# EAGLE schematic Controller Board (EAGLE 8.5.1)

## Sheet 1 of 2
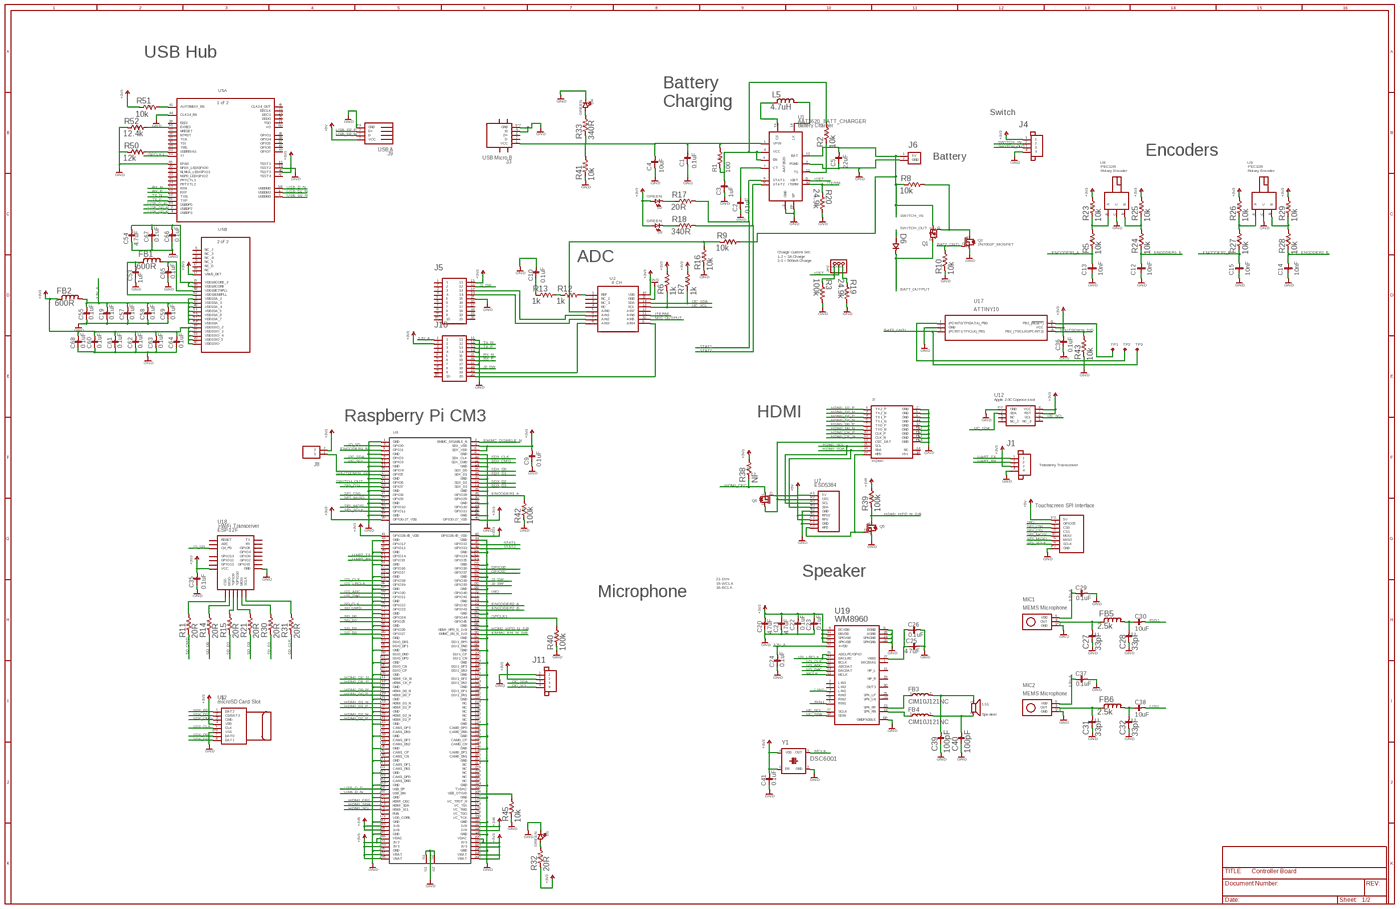
[diagram p0: schematic, sheet 1, overview]
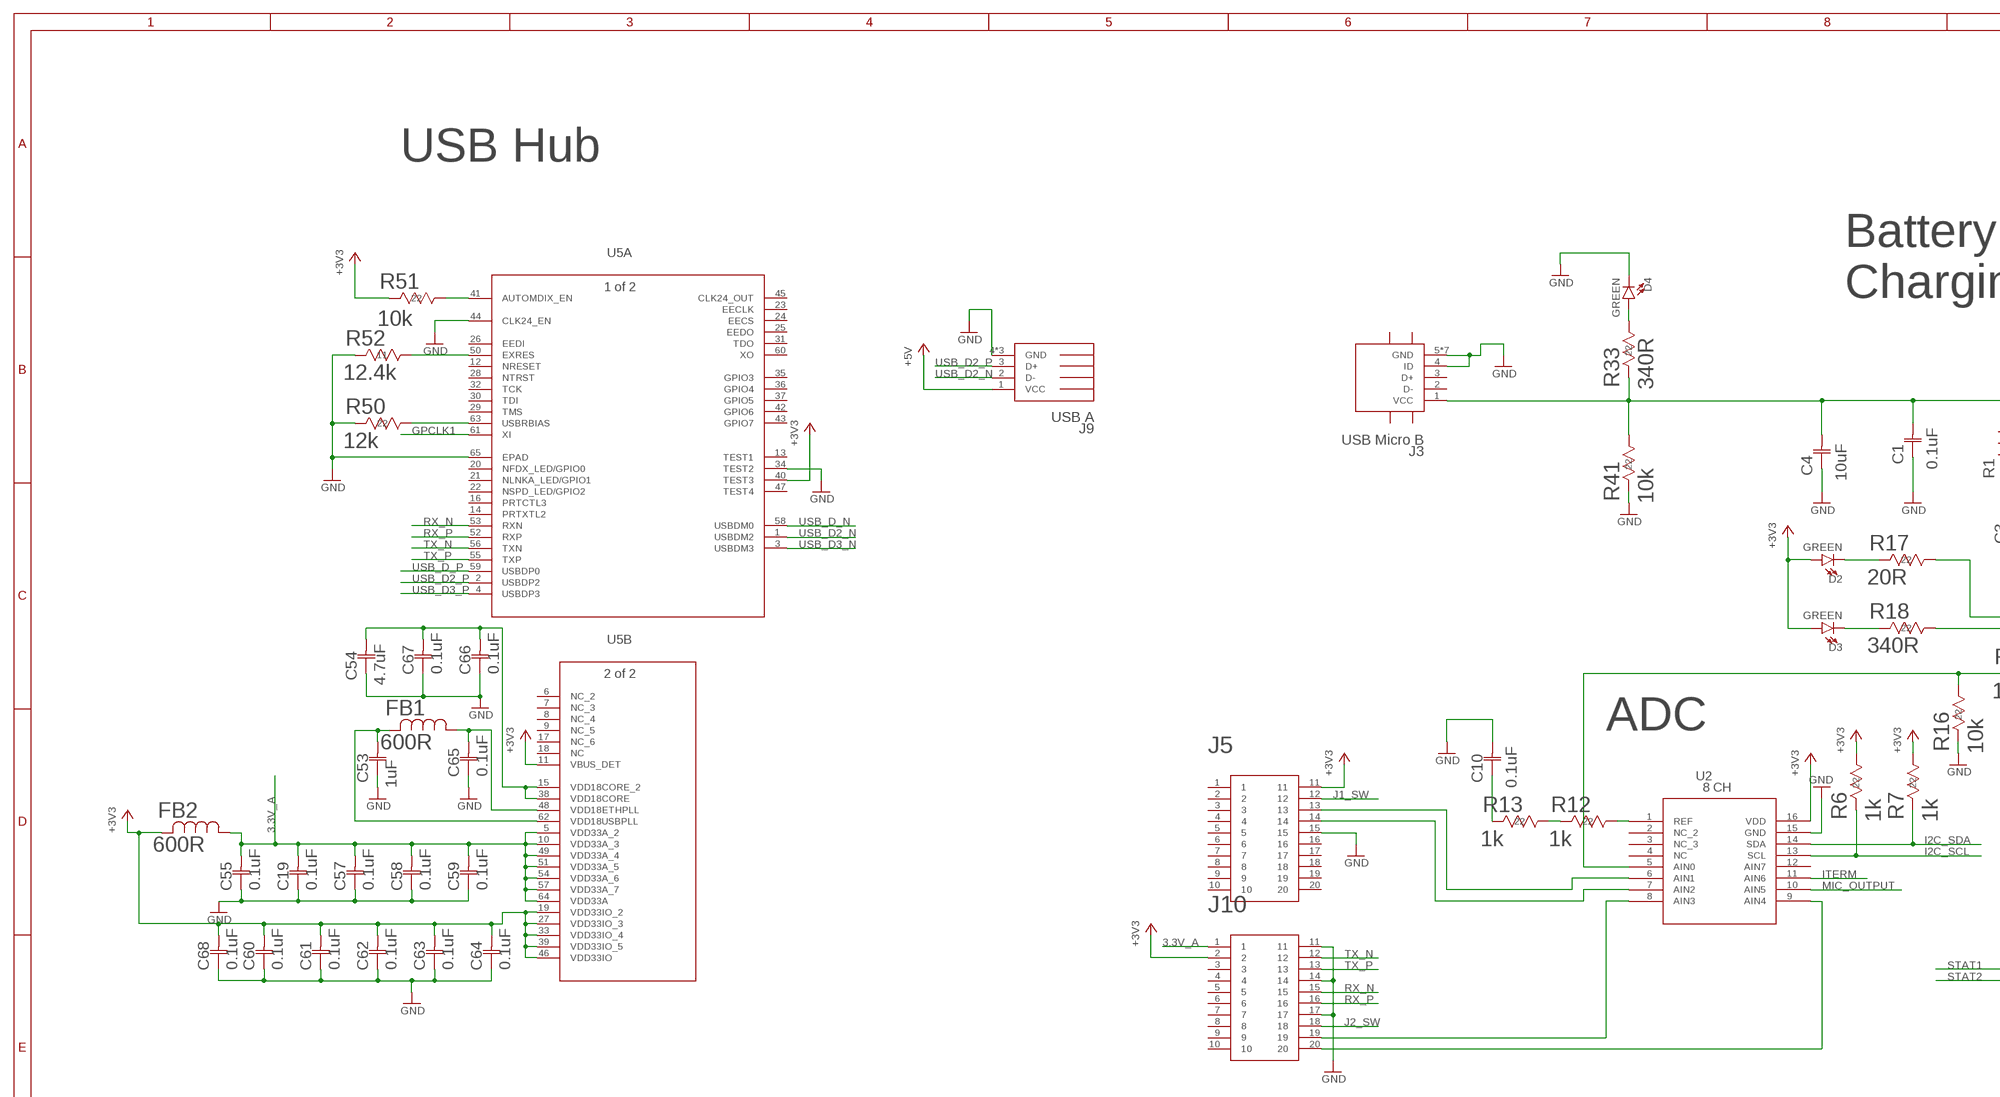
[diagram p1: schematic, sheet 1, part 1 of 4]
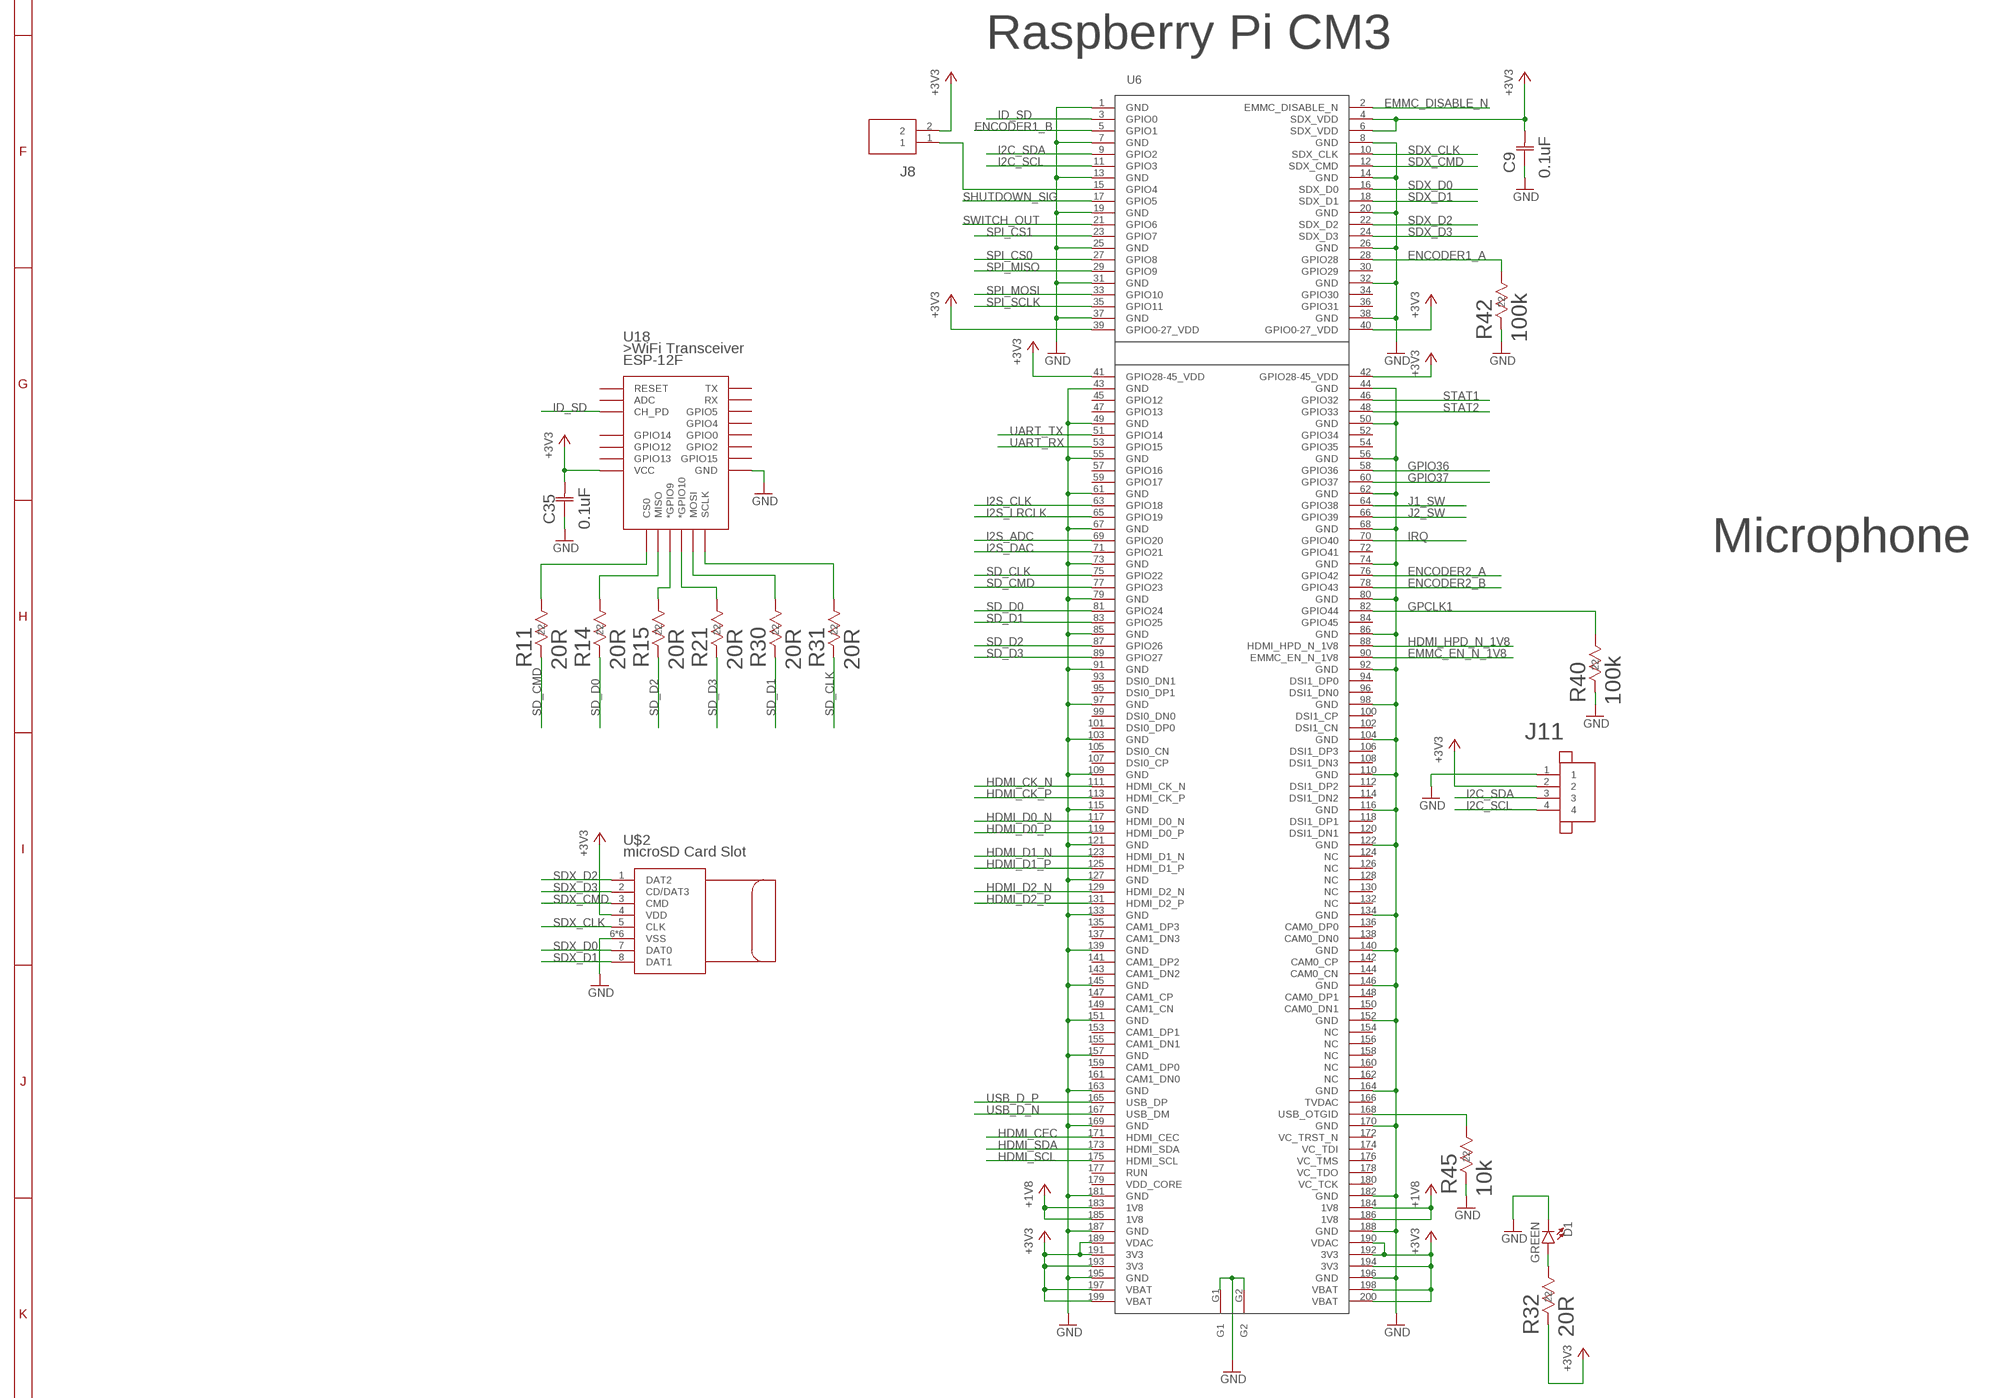
[diagram p2: schematic, sheet 1, part 2 of 4]
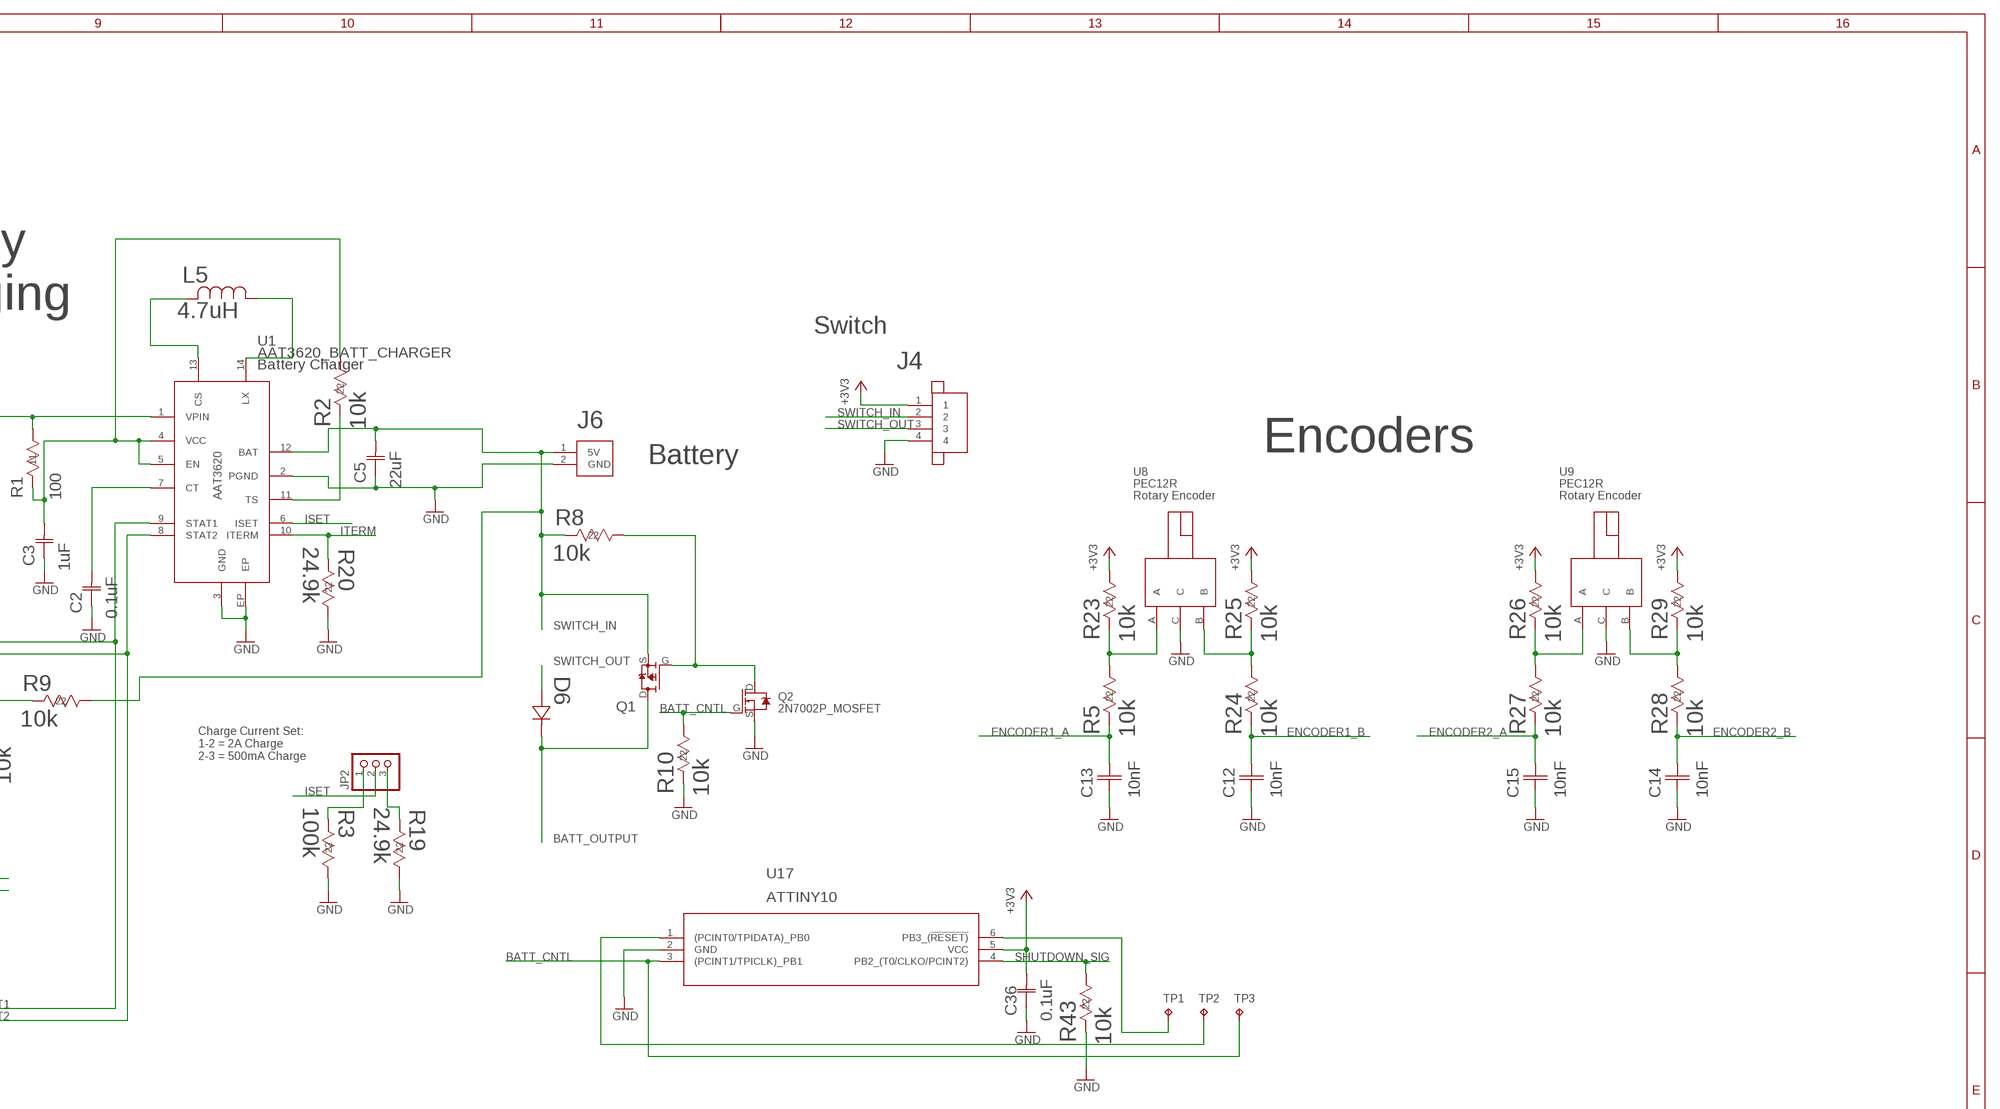
[diagram p3: schematic, sheet 1, part 3 of 4]
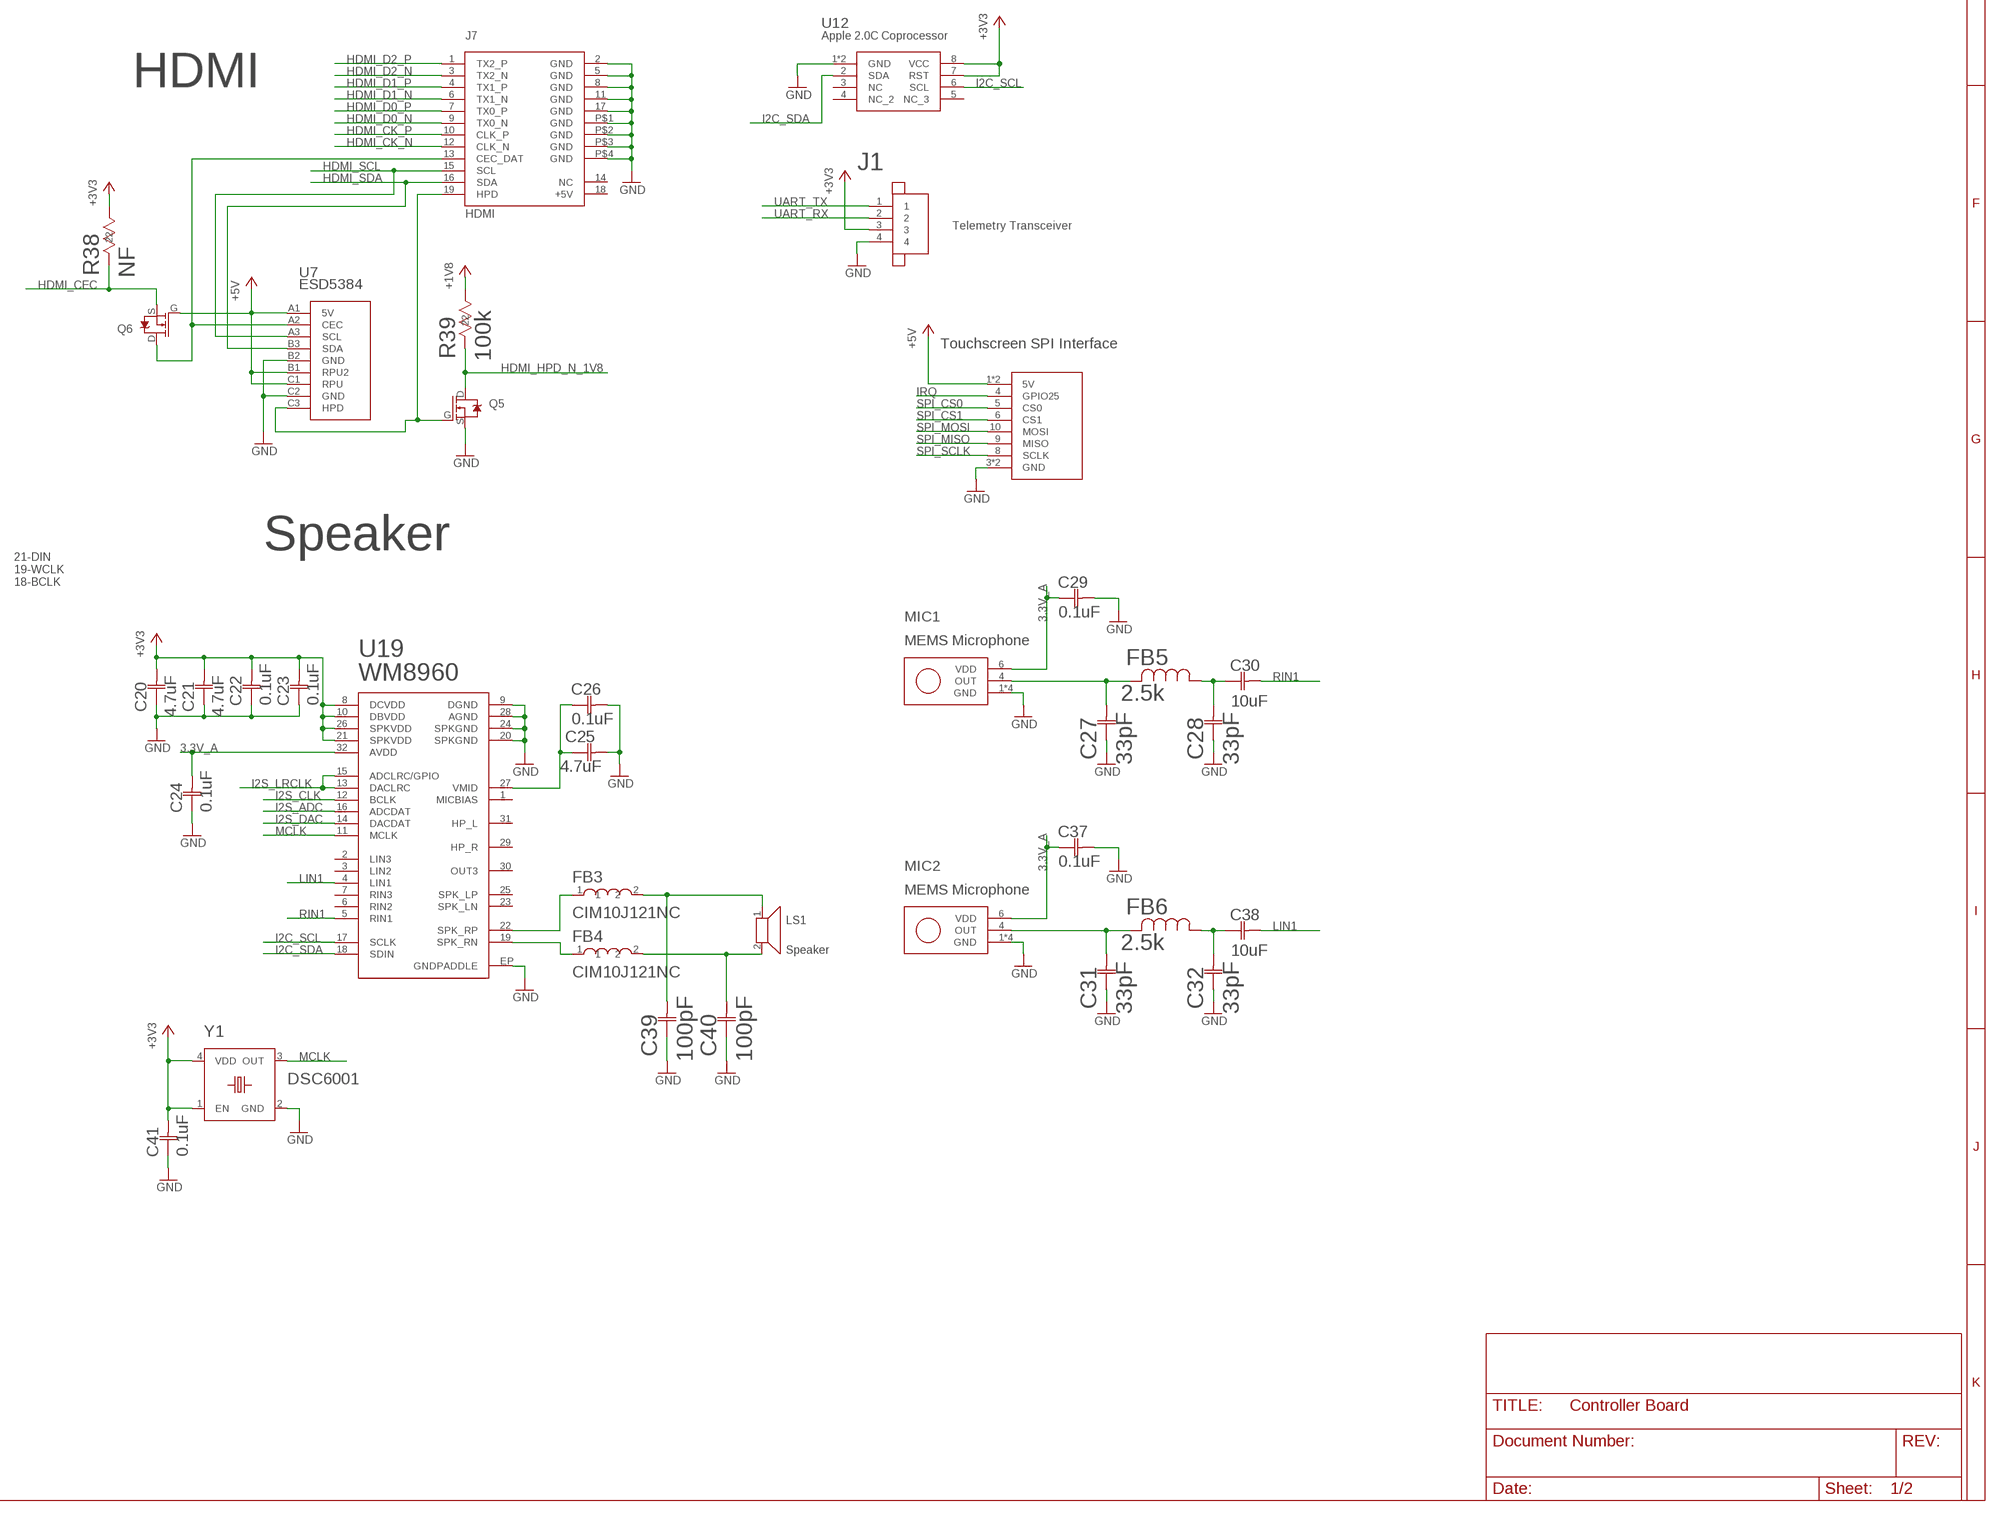
[diagram p4: schematic, sheet 1, part 4 of 4]

### Parts
C1  0.1uF  08055C104KAT2A  [0805]
C2  0.1uF  08055C104KAT2A  [0805]
C3  1uF  CC0805KKX7R7BB105  [YAG_CC0805]
C4  10uF  GRM21BR60J106ME19L  [G-21]
C5  22uF  GRM21BR60J226ME39L  [G-21]
C9  0.1uF  08055C104KAT2A  [0805]
C10  0.1uF  08055C104KAT2A  [0805]
C12  10nF  10NF_CAPACITOR  [0603_CAPACITOR]
C13  10nF  10NF_CAPACITOR  [0603_CAPACITOR]
C14  10nF  10NF_CAPACITOR  [0603_CAPACITOR]
C15  10nF  10NF_CAPACITOR  [0603_CAPACITOR]
C19  0.1uF  0402ZD104KAT2A0402-M  [0402-M]
C20  4.7uF  06036D475KAT2A0603-M  [0603-M]
C21  4.7uF  06036D475KAT2A0603-M  [0603-M]
C22  0.1uF  0402ZD104KAT2A0402-M  [0402-M]
C23  0.1uF  0402ZD104KAT2A0402-M  [0402-M]
C24  0.1uF  0402ZD104KAT2A0402-M  [0402-M]
C25  4.7uF  06036D475KAT2A0603-M  [0603-M]
C26  0.1uF  0402ZD104KAT2A0402-M  [0402-M]
C27  33pF  GRM1555C1H330JA01DG-155-M  [G-155-M]
C28  33pF  GRM1555C1H330JA01DG-155-M  [G-155-M]
C29  0.1uF  0402ZD104KAT2A0402-M  [0402-M]
C30  10uF  GRM21BR60J106ME19L  [G-21]
C31  33pF  GRM1555C1H330JA01DG-155-M  [G-155-M]
C32  33pF  GRM1555C1H330JA01DG-155-M  [G-155-M]
C35  0.1uF  08055C104KAT2A  [0805]
C36  0.1uF  08055C104KAT2A  [0805]
C37  0.1uF  0402ZD104KAT2A0402-M  [0402-M]
C38  10uF  GRM21BR60J106ME19L  [G-21]
C39  100pF  CC0402KRX7R9BB101YAG_CC0402-M  [YAG_CC0402-M]
C40  100pF  CC0402KRX7R9BB101YAG_CC0402-M  [YAG_CC0402-M]
C41  0.1uF  0402ZD104KAT2A0402-M  [0402-M]
C53  1uF  CC0805KKX7R7BB105  [YAG_CC0805]
C54  4.7uF  06036D475KAT2A0603-M  [0603-M]
C55  0.1uF  0402ZD104KAT2A0402-M  [0402-M]
C57  0.1uF  0402ZD104KAT2A0402-M  [0402-M]
C58  0.1uF  0402ZD104KAT2A0402-M  [0402-M]
C59  0.1uF  0402ZD104KAT2A0402-M  [0402-M]
C60  0.1uF  0402ZD104KAT2A0402-M  [0402-M]
C61  0.1uF  0402ZD104KAT2A0402-M  [0402-M]
C62  0.1uF  0402ZD104KAT2A0402-M  [0402-M]
C63  0.1uF  0402ZD104KAT2A0402-M  [0402-M]
C64  0.1uF  0402ZD104KAT2A0402-M  [0402-M]
C65  0.1uF  0402ZD104KAT2A0402-M  [0402-M]
C66  0.1uF  0402ZD104KAT2A0402-M  [0402-M]
C67  0.1uF  0402ZD104KAT2A0402-M  [0402-M]
C68  0.1uF  0402ZD104KAT2A0402-M  [0402-M]
D1  GREEN  LED-GREEN0603  [LED-0603]
D2  GREEN  LED-GREEN0603  [LED-0603]
D3  GREEN  LED-GREEN0603  [LED-0603]
D4  GREEN  LED-GREEN0603  [LED-0603]
D6  1N4148W-7-FSOD123-M  [SOD123-M]
FB1  600R  BLM18AG601SN1DIND_BLM18_0603-M  [IND_BLM18_0603-M]
FB2  600R  BLM18AG601SN1DIND_BLM18_0603-M  [IND_BLM18_0603-M]
FB3  CIM10J121NC  [0603_CAPACITOR]
FB4  CIM10J121NC  [0603_CAPACITOR]
FB5  2.5k  BLM18BD252SN1DIND_BLM18_0603-M  [IND_BLM18_0603-M]
FB6  2.5k  BLM18BD252SN1DIND_BLM18_0603-M  [IND_BLM18_0603-M]
J1  JST_SH_4POS  [JST_SH_4POS]
J2  3.5_TOUCHSCREEN  [3.5_TOUCHSCREEN]
J3  USB_MICRO_B_SMT  [USB_MICRO_B_SMT]
J4  JST_SH_4POS  [JST_SH_4POS]
J5  EDGE_CONNECTOR_20POS  [EDGE_CONNECTOR_20POS]
J6  POWER_CONNECTOR  [XH_CONNECTOR]
J7  HDMI  [HDMI]
J8  2_PIN_CONNECTOR  [XH_CONNECTOR]
J9  USB_A_RECEPT  [USB_A_RECEPT]
J10  EDGE_CONNECTOR_20POS  [EDGE_CONNECTOR_20POS]
J11  JST_SH_4POS  [JST_SH_4POS]
JP2  PINHD-1X3  [1X03]
L5  4.7uH  DFE252012P-4R7M=P2"  [1008]
LS1  SP-1510  [SPEAKER]
MIC1  SPH1642HT5H-1  [SISONIC_MICROPHONE]
MIC2  SPH1642HT5H-1  [SISONIC_MICROPHONE]
Q1  DMP3099L  [SOT-23_(TO-236AB)]
Q2  2N7002P_MOSFET  [SOT-23_(TO-236AB)]
Q5  DMG1012T  [SOT-523]
Q6  DMG1012T  [SOT-523]
R1  100  100_RESISTOR  [1206]
R2  10k  ERA-6AEB103V  [RC0805N]
R3  100k  RC0603JR-07100KLRC0603N-M  [RC0603N-M]
R5  10k  ERA-6AEB103V  [RC0805N]
R6  1k  RC0603JR-071KLRC0603N-M  [RC0603N-M]
R7  1k  RC0603JR-071KLRC0603N-M  [RC0603N-M]
R8  10k  ERA-6AEB103V  [RC0805N]
R9  10k  ERA-6AEB103V  [RC0805N]
R10  10k  ERA-6AEB103V  [RC0805N]
R11  20R  RC0603JR-0720RLRC0603N-M  [RC0603N-M]
R12  1k  RC0603JR-071KLRC0603N-M  [RC0603N-M]
R13  1k  RC0603JR-071KLRC0603N-M  [RC0603N-M]
R14  20R  RC0603JR-0720RLRC0603N-M  [RC0603N-M]
R15  20R  RC0603JR-0720RLRC0603N-M  [RC0603N-M]
R16  10k  ERA-6AEB103V  [RC0805N]
R17  20R  RC0603JR-0720RLRC0603N-M  [RC0603N-M]
R18  340R  RC0603FR-07340RL  [RC0603N]
R19  24.9k  RC0402FR-0724K9LRC0402N-M  [RC0402N-M]
R20  24.9k  RC0402FR-0724K9LRC0402N-M  [RC0402N-M]
R21  20R  RC0603JR-0720RLRC0603N-M  [RC0603N-M]
R23  10k  ERA-6AEB103V  [RC0805N]
R24  10k  ERA-6AEB103V  [RC0805N]
R25  10k  ERA-6AEB103V  [RC0805N]
R26  10k  ERA-6AEB103V  [RC0805N]
R27  10k  ERA-6AEB103V  [RC0805N]
R28  10k  ERA-6AEB103V  [RC0805N]
R29  10k  ERA-6AEB103V  [RC0805N]
R30  20R  RC0603JR-0720RLRC0603N-M  [RC0603N-M]
R31  20R  RC0603JR-0720RLRC0603N-M  [RC0603N-M]
R32  20R  RC0603JR-0720RLRC0603N-M  [RC0603N-M]
R33  340R  RC0603FR-07340RL  [RC0603N]
R38  NF  ERA-6AEB103V  [RC0805N]
R39  100k  RC0603JR-07100KLRC0603N-M  [RC0603N-M]
R40  100k  RC0603JR-07100KLRC0603N-M  [RC0603N-M]
R41  10k  ERA-6AEB103V  [RC0805N]
R42  100k  RC0603JR-07100KLRC0603N-M  [RC0603N-M]
R43  10k  ERA-6AEB103V  [RC0805N]
R45  10k  ERA-6AEB103V  [RC0805N]
R50  12k  RC0402FR-0712KLRC0402N-M  [RC0402N-M]
R51  10k  ERA-6AEB103V  [RC0805N]
R52  12.4k  RC0402FR-0712K4LYAG_R0402-M  [YAG_R0402-M]
TP1  TPB2,54  [B2,54]
TP2  TPB2,54  [B2,54]
TP3  TPB2,54  [B2,54]
U1  AAT3620_BATT_CHARGER  [AAT3620_TDFN]
U2  8 CH  MAX11608EEE+21-0055H_16-M  [21-0055H_16-M]
U5  LAN9512-JZXQFN64_9X9MC-M  [QFN64_9X9MC-M]
U6  COMPUTE_MODULE  [SO-DIMM]
U7  ESD5384  [WLCSP9]
U8  PEC12R  [PEC12R]
U9  PEC12R  [PEC12R]
U12  APPLE_2.0C_COPROCESSOR  [PG-USON-8-1]
U17  ATTINY10-TSHR6ST1-M  [6ST1-M]
U18  ESP12ESMD  [ESP12E-SMD]
U19  WM8960  [32QFN]
U$2  MICROSD  [MICROSD]
Y1  DSC6001  [4-VFLGA]

### Nets
3.3V_A: C19.2 C24.2 C29.1 C37.1 C55.2 C57.2 C58.2 C59.2 FB2.1 J10.1 MIC1.6(VDD) MIC2.6(VDD) U5.5(B:VDD33A_2) U5.10(B:VDD33A_3) U5.49(B:VDD33A_4) U5.51(B:VDD33A_5) U5.54(B:VDD33A_6) U5.57(B:VDD33A_7) U5.64(B:VDD33A) U19.32(AVDD)
+1V8: R39.1 U6.183(1V8) U6.184(1V8) U6.185(1V8) U6.186(1V8) ; also sheet 2
+3V3: C9.2 C20.2 C21.2 C22.2 C23.2 C35.2 C36.2 C41.2 C60.2 C61.2 C62.2 C63.2 C64.2 C68.2 D2.A D3.A FB2.2 J1.3 J4.1 J5.11 J8.2 J10.2 J11.2 R6.1 R7.1 R23.1 R25.1 R26.1 R29.1 R32.2 R38.1 R51.2 U2.16(VDD) U5.11(B:VBUS_DET) U5.19(B:VDD33IO_2) U5.27(B:VDD33IO_3) U5.33(B:VDD33IO_4) U5.39(B:VDD33IO_5) U5.40(A:TEST3) U5.46(B:VDD33IO) U6.4(SDX_VDD) U6.6(SDX_VDD) U6.39(GPIO0-27_VDD) U6.40(GPIO0-27_VDD) U6.41(GPIO28-45_VDD) U6.42(GPIO28-45_VDD) U6.189(VDAC) U6.190(VDAC) U6.191(3V3) U6.192(3V3) U6.193(3V3) U6.194(3V3) U6.197(VBAT) U6.198(VBAT) U6.199(VBAT) U6.200(VBAT) U12.7(RST) U12.8(VCC) U17.5(VCC) U18.VCC U19.8(DCVDD) U19.10(DBVDD) U19.21(SPKVDD) U19.26(SPKVDD) U$2.4(VDD) Y1.1(EN) Y1.4(VDD) ; also sheet 2
+5V: J2.1(5V) J2.2(5V) J9.1(VCC) Q6.G U7.A1(5V) U7.B1(RPU2) U7.C1(RPU) ; also sheet 2
BATT_CNTL: Q2.G R10.1 TP3.TP U17.3((PCINT1/TPICLK)_PB1)
BATT_OUTPUT: D6.C Q1.D ; also sheet 2
EMMC_DISABLE_N: U6.2(EMMC_DISABLE_N)
EMMC_EN_N_1V8: U6.90(EMMC_EN_N_1V8)
ENCODER1_A: C13.2 R5.2 R42.1 U6.28(GPIO28)
ENCODER1_B: C12.2 R24.2 U6.5(GPIO1)
ENCODER2_A: C15.2 R27.2 U6.76(GPIO42)
ENCODER2_B: C14.2 R28.2 U6.78(GPIO43)
GND: C1.1 C2.1 C3.1 C4.1 C5.1 C9.1 C10.2 C12.1 C13.1 C14.1 C15.1 C19.1 C20.1 C21.1 C22.1 C23.1 C24.1 C25.2 C26.2 C27.1 C28.1 C29.2 C31.1 C32.1 C35.1 C36.1 C37.2 C39.1 C40.1 C41.1 C53.1 C54.1 C55.1 C57.1 C58.1 C59.1 C60.1 C61.1 C62.1 C63.1 C64.1 C65.1 C66.1 C67.1 C68.1 D1.C D4.C J1.4 J2.3(GND) J2.7(GND) J3.4(ID) J3.5(GND) J3.6(GND) J3.7(GND) J3.P$1(GND) J3.P$2(GND) J3.P$3(GND) J3.P$4(GND) J4.4 J5.15 J6.2(GND) J7.2(GND) J7.5(GND) J7.8(GND) J7.11(GND) J7.17(GND) J7.P$1(GND) J7.P$2(GND) J7.P$3(GND) J7.P$4(GND) J9.4(GND) J9.5(GND) J9.6(GND) J10.11 J10.14 J10.17 J11.1 MIC1.1(GND) MIC1.2(GND) MIC1.3(GND) MIC1.5(GND) MIC2.1(GND) MIC2.2(GND) MIC2.3(GND) MIC2.5(GND) Q2.S Q5.S R3.1 R10.2 R16.2 R19.1 R20.1 R40.2 R41.2 R42.2 R43.2 R45.2 R50.2 R52.1 U1.2(PGND) U1.3(GND) U1.EP U2.15(GND) U5.34(A:TEST2) U5.44(A:CLK24_EN) U5.65(A:EPAD) U6.1(GND) U6.7(GND) U6.8(GND) U6.13(GND) U6.14(GND) U6.19(GND) U6.20(GND) U6.25(GND) U6.26(GND) U6.31(GND) U6.32(GND) U6.37(GND) U6.38(GND) U6.43(GND) U6.44(GND) U6.49(GND) U6.50(GND) U6.55(GND) U6.56(GND) U6.61(GND) U6.62(GND) U6.67(GND) U6.68(GND) U6.73(GND) U6.74(GND) U6.79(GND) U6.80(GND) U6.85(GND) U6.86(GND) U6.91(GND) U6.92(GND) U6.97(GND) U6.98(GND) U6.103(GND) U6.104(GND) U6.109(GND) U6.110(GND) U6.115(GND) U6.116(GND) U6.121(GND) U6.122(GND) U6.127(GND) U6.133(GND) U6.134(GND) U6.139(GND) U6.140(GND) U6.145(GND) U6.146(GND) U6.151(GND) U6.152(GND) U6.157(GND) U6.163(GND) U6.164(GND) U6.169(GND) U6.170(GND) U6.181(GND) U6.182(GND) U6.187(GND) U6.188(GND) U6.195(GND) U6.196(GND) U6.G1 U6.G2 U7.B2(GND) U7.C2(GND) U8.C U9.C U12.1(GND) U12.9(GND) U17.2(GND) U18.GND U19.9(DGND) U19.20(SPKGND) U19.24(SPKGND) U19.28(AGND) U19.EP(GNDPADDLE) U$2.6(VSS) U$2.9(VSS) U$2.10(VSS) U$2.11(VSS) U$2.12(VSS) U$2.13(VSS) Y1.2(GND) ; also sheet 2
GPCLK1: R40.1 U5.61(A:XI) U6.82(GPIO44)
GPIO36: U6.58(GPIO36)
GPIO37: U6.60(GPIO37)
HDMI_CEC: Q6.S R38.2 U6.171(HDMI_CEC)
HDMI_CK_N: J7.12(CLK_N) U6.111(HDMI_CK_N)
HDMI_CK_P: J7.10(CLK_P) U6.113(HDMI_CK_P)
HDMI_D0_N: J7.9(TX0_N) U6.117(HDMI_D0_N)
HDMI_D0_P: J7.7(TX0_P) U6.119(HDMI_D0_P)
HDMI_D1_N: J7.6(TX1_N) U6.123(HDMI_D1_N)
HDMI_D1_P: J7.4(TX1_P) U6.125(HDMI_D1_P)
HDMI_D2_N: J7.3(TX2_N) U6.129(HDMI_D2_N)
HDMI_D2_P: J7.1(TX2_P) U6.131(HDMI_D2_P)
HDMI_HPD_N_1V8: Q5.D R39.2 U6.88(HDMI_HPD_N_1V8)
HDMI_SCL: J7.15(SCL) U6.175(HDMI_SCL) U7.A3(SCL)
HDMI_SDA: J7.16(SDA) U6.173(HDMI_SDA) U7.B3(SDA)
I2C_SCL: J11.4 R6.2 U2.13(SCL) U6.11(GPIO3) U12.6(SCL) U19.17(SCLK)
I2C_SDA: J11.3 R7.2 U2.14(SDA) U6.9(GPIO2) U12.2(SDA) U19.18(SDIN)
I2S_ADC: U6.69(GPIO20) U19.16(ADCDAT)
I2S_CLK: U6.63(GPIO18) U19.12(BCLK)
I2S_DAC: U6.71(GPIO21) U19.14(DACDAT)
I2S_LRCLK: U6.65(GPIO19) U19.13(DACLRC) U19.15(ADCLRC/GPIO)
ID_SD: U6.3(GPIO0) U18.CH_PD
IRQ: J2.4(GPIO25) U6.70(GPIO40)
ISET: JP2.2 U1.6(ISET)
ITERM: R20.2 U1.10(ITERM) U2.11(AIN6)
J1_SW: J5.12 U6.64(GPIO38)
J2_SW: J10.18 U6.66(GPIO39)
LIN1: C38.2 U19.4(LIN1)
MCLK: U19.11(MCLK) Y1.3(OUT)
MIC_OUTPUT: U2.10(AIN5)
N$1: TP1.TP U17.6(PB3_(!RESET))
N$2: C2.2 U1.7(CT)
N$3: R14.1 U18.MISO
N$4: L5.P$2 U1.13(CS)
N$5: L5.P$1 U1.14(LX)
N$6: C3.2 R1.1 R2.1 U1.4(VCC) U1.5(EN)
N$7: R11.1 U18.CS0
N$9: D4.A R33.1
N$10: D1.A R32.1
N$11: R2.2 U1.11(TS)
N$14: C25.1 C26.1 U19.27(VMID)
N$15: D2.C R17.2
N$16: R12.1 U2.1(REF)
N$17: J5.13 U2.6(AIN1)
N$18: J5.14 U2.7(AIN2)
N$19: J10.19 U2.8(AIN3)
N$20: J10.20 U2.9(AIN4)
N$21: C27.2 FB5.2 MIC1.4(OUT)
N$22: D3.C R18.2
N$24: R12.2 R13.1
N$25: R15.1 U18.GPIO9(*GPIO9)
N$26: R21.1 U18.GPIO10(*GPIO10)
N$27: R30.1 U18.MOSI
N$28: C10.1 R13.2
N$31: R5.1 R23.2 U8.A
N$33: C28.2 C30.1 FB5.1
N$34: R24.1 R25.2 U8.B
N$35: C31.2 FB6.2 MIC2.4(OUT)
N$36: C32.2 C38.1 FB6.1
N$37: R26.2 R27.1 U9.A
N$38: R28.1 R29.2 U9.B
N$39: R9.2 R16.1 U2.5(AIN0)
N$40: JP2.1 R3.2
N$41: FB4.1 U19.19(SPK_RN)
N$42: JP2.3 R19.2
N$43: FB3.1 U19.22(SPK_RP)
N$44: C39.2 FB3.2 LS1.1
N$45: C40.2 FB4.2 LS1.2
N$46: R31.1 U18.SCLK
N$49: J7.13(CEC_DAT) Q6.D U7.A2(CEC)
N$50: J7.19(HPD) Q5.G U7.C3(HPD)
N$53: R45.1 U6.168(USB_OTGID)
N$54: J8.1 U6.15(GPIO4)
N$55: R51.1 U5.41(A:AUTOMDIX_EN)
N$56: R50.1 U5.63(A:USBRBIAS)
N$57: Q1.G Q2.D R8.1
N$58: C65.2 FB1.1 U5.48(B:VDD18ETHPLL)
N$59: C53.2 FB1.2 U5.62(B:VDD18USBPLL)
N$60: R52.2 U5.50(A:EXRES)
N$62: C54.2 C66.2 C67.2 U5.15(B:VDD18CORE_2) U5.38(B:VDD18CORE)
PB0: TP2.TP U17.1((PCINT0/TPIDATA)_PB0)
RIN1: C30.2 U19.5(RIN1)
RX_N: J10.15 U5.53(A:RXN)
RX_P: J10.16 U5.52(A:RXP)
SD_CLK: R31.2 U6.75(GPIO22)
SD_CMD: R11.2 U6.77(GPIO23)
SD_D0: R14.2 U6.81(GPIO24)
SD_D1: R30.2 U6.83(GPIO25)
SD_D2: R15.2 U6.87(GPIO26)
SD_D3: R21.2 U6.89(GPIO27)
SDX_CLK: U6.10(SDX_CLK) U$2.5(CLK)
SDX_CMD: U6.12(SDX_CMD) U$2.3(CMD)
SDX_D0: U6.16(SDX_D0) U$2.7(DAT0)
SDX_D1: U6.18(SDX_D1) U$2.8(DAT1)
SDX_D2: U6.22(SDX_D2) U$2.1(DAT2)
SDX_D3: U6.24(SDX_D3) U$2.2(CD/DAT3)
SHUTDOWN_SIG: R43.1 U6.17(GPIO5) U17.4(PB2_(T0/CLKO/PCINT2))
SPI_CS0: J2.5(CS0) U6.27(GPIO8)
SPI_CS1: J2.6(CS1) U6.23(GPIO7)
SPI_MISO: J2.9(MISO) U6.29(GPIO9)
SPI_MOSI: J2.10(MOSI) U6.33(GPIO10)
SPI_SCLK: J2.8(SCLK) U6.35(GPIO11)
STAT1: R17.1 U1.9(STAT1) U6.46(GPIO32)
STAT2: R18.1 U1.8(STAT2) U6.48(GPIO33)
SWITCH_IN: C5.2 J4.2 J6.1(5V) Q1.S R8.2 R9.1 U1.12(BAT)
SWITCH_OUT: D6.A J4.3 U6.21(GPIO6)
TX_N: J10.12 U5.56(A:TXN)
TX_P: J10.13 U5.55(A:TXP)
UART_RX: J1.2 U6.53(GPIO15)
UART_TX: J1.1 U6.51(GPIO14)
USB_5V: C1.2 C4.2 J3.1(VCC) R1.2 R33.2 R41.1 U1.1(VPIN)
USB_D2_N: J9.2(D-) U5.1(A:USBDM2)
USB_D2_P: J9.3(D+) U5.2(A:USBDP2)
USB_D3_N: U5.3(A:USBDM3)
USB_D3_P: U5.4(A:USBDP3)
USB_D_N: U5.58(A:USBDM0) U6.167(USB_DM)
USB_D_P: U5.59(A:USBDP0) U6.165(USB_DP)
Unconnected: J3.2(D-) J3.3(D+) J5.1 J5.2 J5.3 J5.4 J5.5 J5.6 J5.7 J5.8 J5.9 J5.10 J5.16 J5.17 J5.18 J5.19 J5.20 J7.14(NC) J7.18(+5V) J10.3 J10.4 J10.5 J10.6 J10.7 J10.8 J10.9 J10.10 U2.2(NC_2) U2.3(NC_3) U2.4(NC) U2.12(AIN7) U5.6(B:NC_2) U5.7(B:NC_3) U5.8(B:NC_4) U5.9(B:NC_5) U5.12(A:NRESET) U5.13(A:TEST1) U5.14(A:PRTXTL2) U5.16(A:PRTCTL3) U5.17(B:NC_6) U5.18(B:NC) U5.20(A:NFDX_LED/GPIO0) U5.21(A:NLNKA_LED/GPIO1) U5.22(A:NSPD_LED/GPIO2) U5.23(A:EECLK) U5.24(A:EECS) U5.25(A:EEDO) U5.26(A:EEDI) U5.28(A:NTRST) U5.29(A:TMS) U5.30(A:TDI) U5.31(A:TDO) U5.32(A:TCK) U5.35(A:GPIO3) U5.36(A:GPIO4) U5.37(A:GPIO5) U5.42(A:GPIO6) U5.43(A:GPIO7) U5.45(A:CLK24_OUT) U5.47(A:TEST4) U5.60(A:XO) U6.30(GPIO29) U6.34(GPIO30) U6.36(GPIO31) U6.45(GPIO12) U6.47(GPIO13) U6.52(GPIO34) U6.54(GPIO35) U6.57(GPIO16) U6.59(GPIO17) U6.72(GPIO41) U6.84(GPIO45) U6.93(DSI0_DN1) U6.94(DSI1_DP0) U6.95(DSI0_DP1) U6.96(DSI1_DN0) U6.99(DSI0_DN0) U6.100(DSI1_CP) U6.101(DSI0_DP0) U6.102(DSI1_CN) U6.105(DSI0_CN) U6.106(DSI1_DP3) U6.107(DSI0_CP) U6.108(DSI1_DN3) U6.112(DSI1_DP2) U6.114(DSI1_DN2) U6.118(DSI1_DP1) U6.120(DSI1_DN1) U6.124(NC) U6.126(NC) U6.128(NC) U6.130(NC) U6.132(NC) U6.135(CAM1_DP3) U6.136(CAM0_DP0) U6.137(CAM1_DN3) U6.138(CAM0_DN0) U6.141(CAM1_DP2) U6.142(CAM0_CP) U6.143(CAM1_DN2) U6.144(CAM0_CN) U6.147(CAM1_CP) U6.148(CAM0_DP1) U6.149(CAM1_CN) U6.150(CAM0_DN1) U6.153(CAM1_DP1) U6.154(NC) U6.155(CAM1_DN1) U6.156(NC) U6.158(NC) U6.159(CAM1_DP0) U6.160(NC) U6.161(CAM1_DN0) U6.162(NC) U6.166(TVDAC) U6.172(VC_TRST_N) U6.174(VC_TDI) U6.176(VC_TMS) U6.177(RUN) U6.178(VC_TDO) U6.179(VDD_CORE) U6.180(VC_TCK) U12.3(NC) U12.4(NC_2) U12.5(NC_3) U18.ADC U18.GPIO0 U18.GPIO2 U18.GPIO4 U18.GPIO5 U18.GPIO12 U18.GPIO13 U18.GPIO14 U18.GPIO15 U18.RESET U18.RXD0(RX) U18.TXD0(TX) U19.1(MICBIAS) U19.2(LIN3) U19.3(LIN2) U19.6(RIN2) U19.7(RIN3) U19.23(SPK_LN) U19.25(SPK_LP) U19.29(HP_R) U19.30(OUT3) U19.31(HP_L)

### Notes on the sheet
- USB Hub
- Battery
  Charging
- Switch
- Encoders
- Battery
- ADC
- Charge Current Set:
  1-2 = 2A Charge
  2-3 = 500mA Charge
- Raspberry Pi CM3 | HDMI
- Telemetry Transceiver
- Speaker
- 21-DIN
  19-WCLK
  18-BCLK
- Microphone

## Sheet 2 of 2
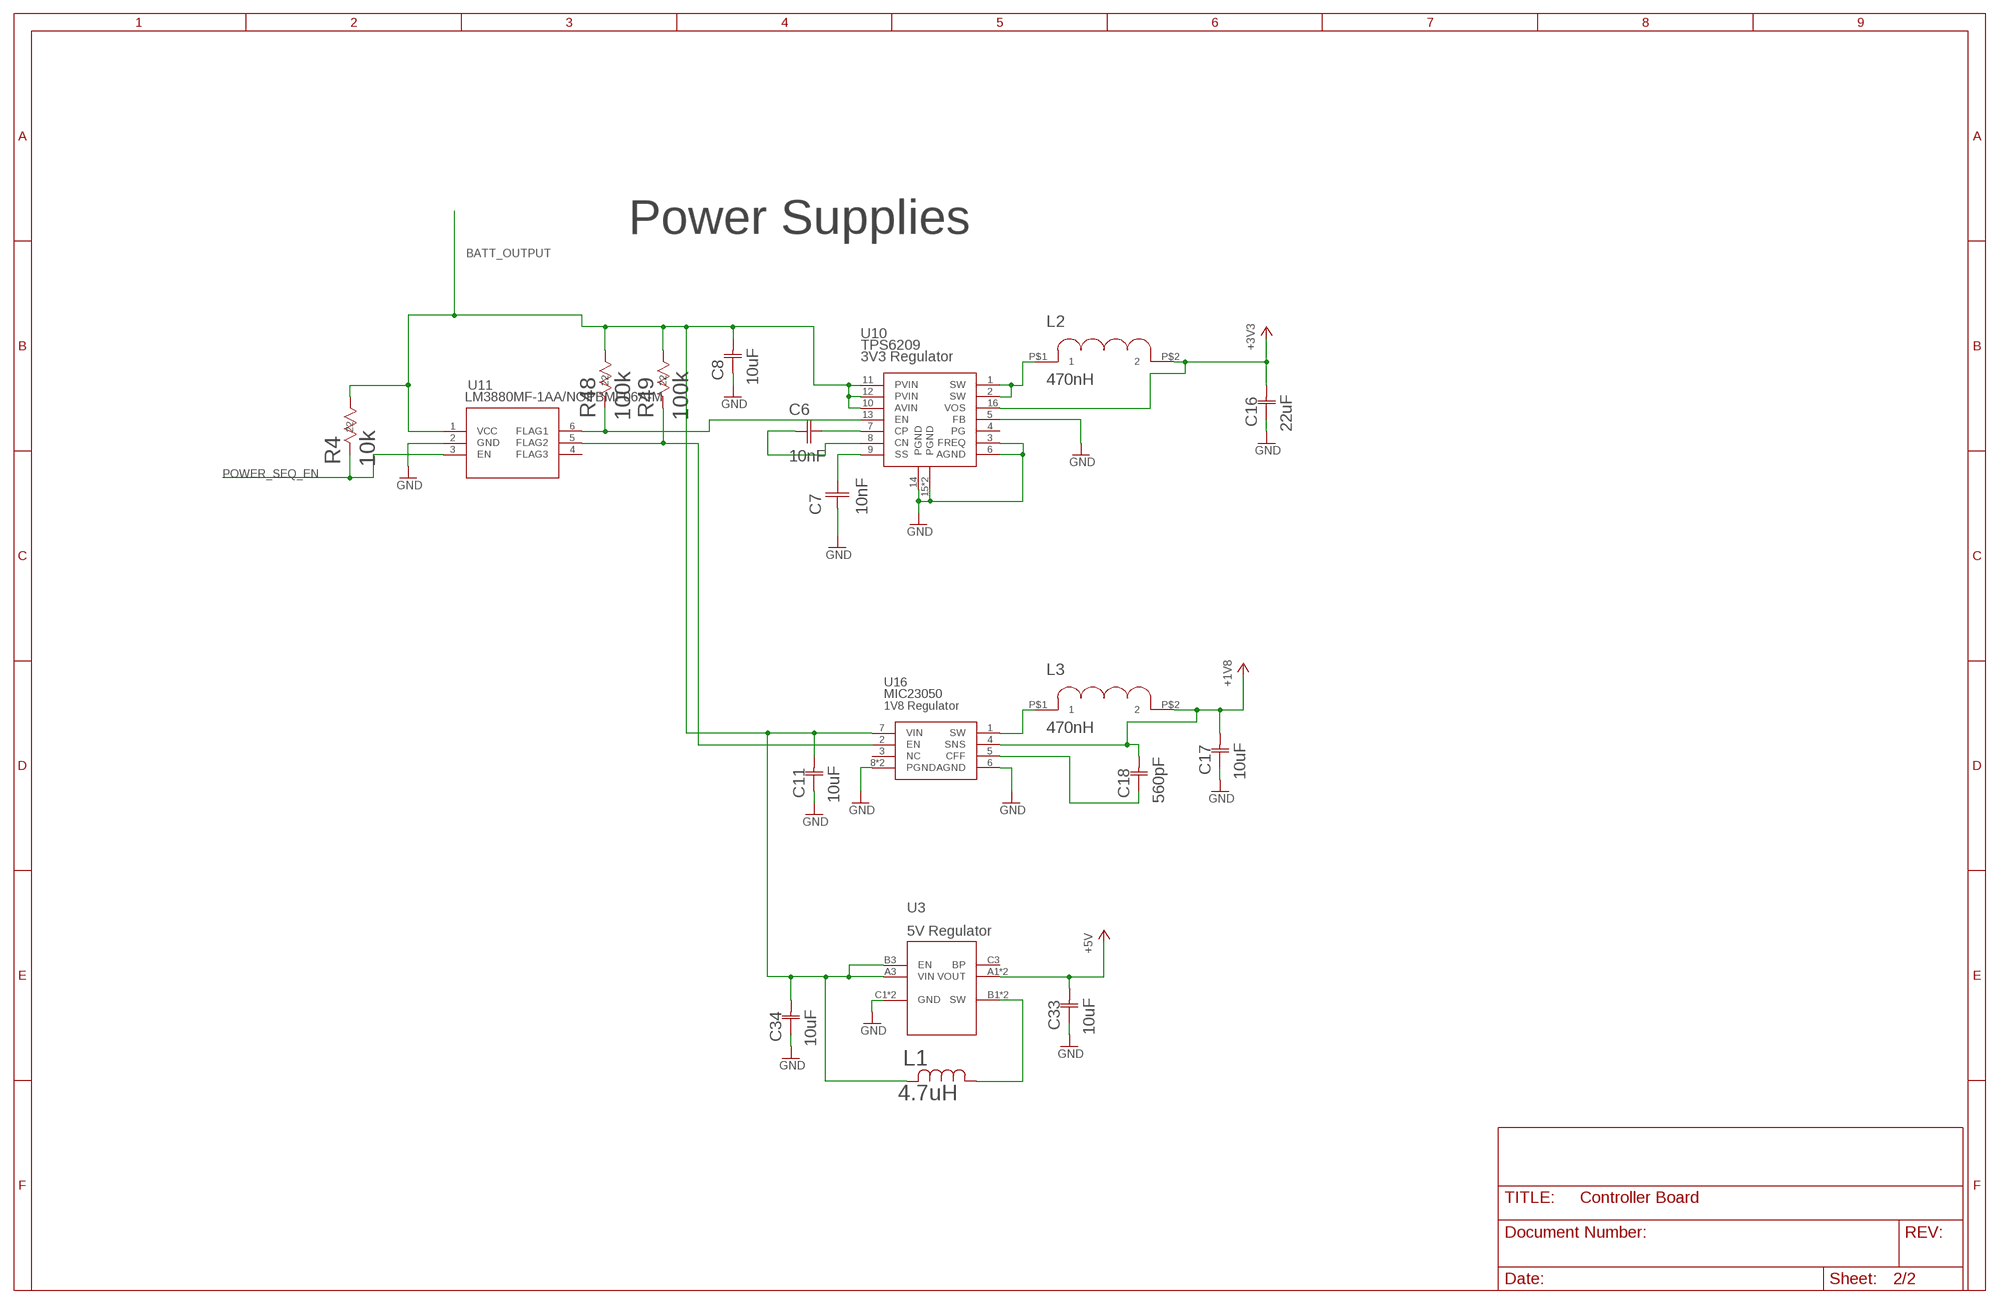
[diagram p5: schematic, sheet 2]

### Parts
C6  10nF  10NF_CAPACITOR  [0603_CAPACITOR]
C7  10nF  10NF_CAPACITOR  [0603_CAPACITOR]
C8  10uF  GRM21BR60J106ME19L  [G-21]
C11  10uF  GRM21BR60J106ME19L  [G-21]
C16  22uF  GRM21BR60J226ME39L  [G-21]
C17  10uF  GRM21BR60J106ME19L  [G-21]
C18  560pF  CC0402KRX7R9BB561CC0402N-M  [CC0402N-M]
C33  10uF  GRM21BR60J106ME19L  [G-21]
C34  10uF  GRM21BR60J106ME19L  [G-21]
L1  4.7uH  DFE252012P-4R7M=P2"  [1008]
L2  470nH  470NH_INDUCTOR  [470NH_INDUCTOR]
L3  470nH  470NH_INDUCTOR  [470NH_INDUCTOR]
R4  10k  ERA-6AEB103V  [RC0805N]
R48  100k  RC0603JR-07100KLRC0603N-M  [RC0603N-M]
R49  100k  RC0603JR-07100KLRC0603N-M  [RC0603N-M]
U3  TPS61256YFFR  [YFF9]
U10  TPS6209  [VQFN16]
U11  LM3880MF-1AA/NOPBMF06A-M  [MF06A-M]
U16  MIC23050  [MLF(ML)_8PIN]

### Nets
+1V8: C17.2 C18.2 L3.P$2 U16.4(SNS) ; also sheet 1
+3V3: C16.2 L2.P$2 U10.16(VOS) ; also sheet 1
+5V: C33.2 U3.A1(VOUT) U3.A2(VOUT) ; also sheet 1
BATT_OUTPUT: C8.2 C11.2 C34.2 L1.P$2 R4.1 R48.1 R49.1 U3.A3(VIN) U3.B3(EN) U10.10(AVIN) U10.11(PVIN) U10.12(PVIN) U11.1(VCC) U16.7(VIN) ; also sheet 1
GND: C7.1 C8.1 C11.1 C16.1 C17.1 C33.1 C34.1 U3.C1(GND) U3.C2(GND) U10.3(FREQ) U10.5(FB) U10.6(AGND) U10.14(PGND) U10.15(PGND) U10.17(PGND) U11.2(GND) U16.6(AGND) U16.8(PGND) U16.EP(PGND) ; also sheet 1
N$8: R48.2 U10.13(EN) U11.6(FLAG1)
N$12: R49.2 U11.5(FLAG2) U16.2(EN)
N$13: C6.2 U10.7(CP)
N$23: C6.1 U10.8(CN)
N$29: C7.2 U10.9(SS)
N$30: L2.P$1 U10.1(SW) U10.2(SW)
N$32: L3.P$1 U16.1(SW)
N$48: C18.1 U16.5(CFF)
N$61: L1.P$1 U3.B1(SW) U3.B2(SW)
POWER_SEQ_EN: R4.2 U11.3(EN)
Unconnected: U3.C3(BP) U10.4(PG) U11.4(FLAG3) U16.3(NC)

### Notes on the sheet
- Power Supplies

## Library data of the parts
C1 C2 C9 C10 C35 C36 = Controller Board:08055C104KAT2A; COPYRIGHT: Copyright C 2015 Accelerated Designs. All rights reserved; MANUFACTURER_PART_NUMBER: 08055C104KAT2A; VENDOR: Vendor
C3 = Controller Board:CC0805KKX7R7BB105; COPYRIGHT: Copyright C 2015 Accelerated Designs. All rights reserved; MANUFACTURER_PART_NUMBER: CC0805KKX7R7BB105; VENDOR: Vendor
C4 C8 C11 C17 C33 C34 = Controller Board:GRM21BR60J106ME19L; COPYRIGHT: Copyright C 2015 Accelerated Designs. All rights reserved; MANUFACTURER_PART_NUMBER: GRM21BR60J106ME19L; VENDOR: Vendor
C5 C16 = Controller Board:GRM21BR60J226ME39L; COPYRIGHT: Copyright C 2015 Accelerated Designs. All rights reserved; MANUFACTURER_PART_NUMBER: GRM21BR60J226ME39L; VENDOR: Vendor
C6 C7 C12-C15 = Controller Board:10NF_CAPACITOR
C18 = Controller Board:CC0402KRX7R9BB561; MANUFACTURER_PART_NUMBER: CC0402KRX7R9BB561; VENDOR: Yageo
C19 C22-C24 C26 C29 C37 C41 C55 C57-C68 = 0.1uF-capacitor-0402:0402ZD104KAT2A; MANUFACTURER_PART_NUMBER: 0402ZD104KAT2A; VENDOR: AVX Corporation
C20 C21 C25 C54 = 4.7uF-capacitor:06036D475KAT2A; MANUFACTURER_PART_NUMBER: 06036D475KAT2A; VENDOR: AVX Corporation
C27 C28 C31 C32 = 33pF-capacitor:GRM1555C1H330JA01D; MANUFACTURER_PART_NUMBER: GRM1555C1H330JA01D; VENDOR: Murata
C30 C38 = 10uF X5R Ceramic Capacitor:GRM21BR60J106ME19L; COPYRIGHT: Copyright C 2015 Accelerated Designs. All rights reserved; MANUFACTURER_PART_NUMBER: GRM21BR60J106ME19L; VENDOR: Vendor
C39 C40 = 100pF-capacitor:CC0402KRX7R9BB101; MANUFACTURER_PART_NUMBER: CC0402KRX7R9BB101; VENDOR: Yageo
C53 = 1uF X7R Ceramic Capacitor:CC0805KKX7R7BB105; COPYRIGHT: Copyright C 2015 Accelerated Designs. All rights reserved; MANUFACTURER_PART_NUMBER: CC0805KKX7R7BB105; VENDOR: Vendor
D1-D4 = Controller Board:LED-GREEN: Green SMD LED Used in manufacturing of various products at SparkFun Packages: 0603 - SMD 0603 package [Product Link] <http://www.futureelectronics.com/en/technologies/semiconductors/optoelectronics/leds/Pages/9894312-LTST-C190GKT.aspx?CrossPart=HSMG-C190&IM=0> LilyPad 1206 - SMD1206 LilyPad package [Product Link] <http://www.futureelectronics.com/en/Technologies/Product.aspx?ProductID=IN150NGHARVATEKCORPORATION2049943&IM=0> 1206 - SMD1206 package [Product Link] <http://www.futureelectronics.com/en/technologies/semiconductors/optoelectronics/leds/Pages/8315665-LTST-C150KGKT.aspx?IM=0> 1206 Bottom Mount -SMD 1206 Bottom Mount [Product Link] <http://www.digikey.com/product-detail/en/lite-on-inc/LTST-C230KGKT/160-1456-1-ND/386854> SparkFun Products: Pro Mini 328 -5V <https://www.sparkfun.com/products/821> RedBoard <https://www.sparkfun.com/products/12757> MP3 Trigger <https://www.sparkfun.com/products/13720> Makey Makey <https://www.sparkfun.com/products/11076>; PROD_ID: DIO-00821
D6 = Controller Board:1N4148W-7-F; COPYRIGHT: Copyright C 2015 Accelerated Designs. All rights reserved; MANUFACTURER_PART_NUMBER: 1N4148W7F; VENDOR: Diodes Inc
FB1 FB2 = 600ohm-fb:BLM18AG601SN1D; MANUFACTURER_PART_NUMBER: BLM18AG601SN1D; VENDOR: MURATA
FB3 FB4 = thanics_robotics:CIM10J121NC
FB5 FB6 = 2.5k-fb:BLM18BD252SN1D; MANUFACTURER_PART_NUMBER: BLM18BD252SN1D; VENDOR: MURATA
J1 J4 J11 = thanics_robotics:JST_SH_4POS
J2 = Controller Board:3.5_TOUCHSCREEN
J3 = Controller Board:USB_MICRO_B_SMT
J5 J10 = thanics_robotics:EDGE_CONNECTOR_20POS
J6 = Controller Board:POWER_CONNECTOR
J7 = Controller Board:HDMI
J8 = Controller Board:2_PIN_CONNECTOR
J9 = Controller Board:USB_A_RECEPT
JP2 = Controller Board:PINHD-1X3: PIN HEADER
L1 L5 = 4.7uH-inductor:DFE252012P-4R7M=P2
L2 L3 = Controller Board:470NH_INDUCTOR
LS1 = thanics_robotics:SP-1510
MIC1 MIC2 = thanics_robotics:SPH1642HT5H-1
Q1 = Controller Board:DMP3099L
Q2 = Controller Board:2N7002P_MOSFET
Q5 Q6 = Controller Board:DMG1012T
R1 = Controller Board:100_RESISTOR
R2 R4 R5 R8-R10 R16 R23-R29 R38 R41 R43 R45 = Controller Board:ERA-6AEB103V; CASE: 0805 2012 metric; COMPOSITION: Thin Film; COPYRIGHT: Copyright C 2015 Accelerated Designs. All rights reserved; DATASHEET: httpindustrial.panasonic.comwwwcgijvcr13pz.cgi?E+PZ+3+AOA0026+ERA6AEB103V+7+WW; DIGIKEYPARTNUMBER: P10KDATRND; HEIGHT: 0.024" 0.60mm; LEADSTYLE: Surface Mount SMD SMT; MANUFACTURER_PART_NUMBER: ERA6AEB103V; NUMBEROFTERMINATIONS: 2; PACKAGECASE: 0805 2012 Metric; PACKAGING: Tape &amp Reel TR; POWERWATTS: 0.125W 18W; QUANTITY_AVAILABLE: 225000; RESISTANCEINOHMS: 10.0K; RESISTANCEOHMS: 10K; SIZEDIMENSION: 0.079" L x 0.049" W 2.00mm x 1.25mm; TEMPERATURECOEFFICIENT: 25ppm°C; TOLERANCE: 0.1%; VENDOR: Panasonic; VOLTAGEWORKING: 100V
R3 R39 R40 R42 R48 R49 = Controller Board:RC0603JR-07100KL; MANUFACTURER_PART_NUMBER: RC0603JR07100KL; VENDOR: Yageo
R6 R7 R12 R13 = Controller Board:RC0603JR-071KL; CASE: 0603 1608 metric; COMPOSITION: Thick Film; COPYRIGHT: Copyright C 2015 Accelerated Designs. All rights reserved; DATASHEET: httpwww.yageo.comdocumentsrecentPYuRC0603_51_RoHS_L_4.pdf; DESCRIPTION: RES 1.0K OHM 110W 5% 0603 SMD; DIGIKEYPARTNUMBER: 3111.0KGRTRND; HEIGHT: 0.022" 0.55mm; LEADSTYLE: Surface Mount SMD SMT; MANUFACTURER_PART_NUMBER: RC0603JR071KL; NEWARKPARTNUMBER: 14M7231; NUMBEROFTERMINATIONS: 2; PACKAGECASE: 0603 1608 Metric; PACKAGING: Tape &amp Reel TR; POWERWATTS: 0.1W 110W; QUANTITY_AVAILABLE: 0; RESISTANCEINOHMS: 1.00K; RESISTANCEOHMS: 1K; SIZEDIMENSION: 0.063" L x 0.031" W 1.60mm x 0.80mm; TEMPERATURECOEFFICIENT: 100ppm°C; TOLERANCE: 5%; VENDOR: Yageo; VOLTAGEWORKING: 50V
R11 R14 R15 R17 R21 R30-R32 = Controller Board:RC0603JR-0720RL; MANUFACTURER_PART_NUMBER: RC0603JR0720RL; VENDOR: Yageo
R18 R33 = Controller Board:RC0603FR-07340RL; CASE: 0603 1608 metric; COMPOSITION: Thick Film; COPYRIGHT: Copyright C 2015 Accelerated Designs. All rights reserved; DATASHEET: httpwww.yageo.comdocumentsrecentPYuRC0603_51_RoHS_L_4.pdf; DIGIKEYPARTNUMBER: 311340HRTRND; HEIGHT: 0.022" 0.55mm; LEADSTYLE: Surface Mount SMD SMT; MANUFACTURER_PART_NUMBER: RC0603FR07340RL; NEWARKPARTNUMBER: 66R2325; NUMBEROFTERMINATIONS: 2; PACKAGECASE: 0603 1608 Metric; PACKAGING: Tape &amp Reel TR; POWERWATTS: 0.1W 110W; QUANTITY_AVAILABLE: 95000; RESISTANCEINOHMS: 340; RESISTANCEOHMS: 340; SIZEDIMENSION: 0.063" L x 0.031" W 1.60mm x 0.80mm; TEMPERATURECOEFFICIENT: 100ppm°C; TOLERANCE: 1%; VENDOR: Yageo; VOLTAGEWORKING: 50V
R19 R20 = Controller Board:RC0402FR-0724K9L; MANUFACTURER_PART_NUMBER: RC0402FR0724K9L; VENDOR: Yageo
R50 = 12k-resistor:RC0402FR-0712KL; MANUFACTURER_PART_NUMBER: RC0402FR0712KL; VENDOR: Yageo
R51 = 10k-resistor:ERA-6AEB103V; CASE: 0805 2012 metric; COMPOSITION: Thin Film; COPYRIGHT: Copyright C 2015 Accelerated Designs. All rights reserved; DATASHEET: httpindustrial.panasonic.comwwwcgijvcr13pz.cgi?E+PZ+3+AOA0026+ERA6AEB103V+7+WW; DIGIKEYPARTNUMBER: P10KDATRND; HEIGHT: 0.024" 0.60mm; LEADSTYLE: Surface Mount SMD SMT; MANUFACTURER_PART_NUMBER: ERA6AEB103V; NUMBEROFTERMINATIONS: 2; PACKAGECASE: 0805 2012 Metric; PACKAGING: Tape &amp Reel TR; POWERWATTS: 0.125W 18W; QUANTITY_AVAILABLE: 225000; RESISTANCEINOHMS: 10.0K; RESISTANCEOHMS: 10K; SIZEDIMENSION: 0.079" L x 0.049" W 2.00mm x 1.25mm; TEMPERATURECOEFFICIENT: 25ppm°C; TOLERANCE: 0.1%; VENDOR: Panasonic; VOLTAGEWORKING: 100V
R52 = 12.4k-resistor:RC0402FR-0712K4L; MANUFACTURER_PART_NUMBER: RC0402FR0712K4L; VENDOR: Yageo
TP1-TP3 = testpad:TP: Test pad
U1 = Controller Board:AAT3620_BATT_CHARGER
U2 = Controller Board:MAX11608EEE+; COPYRIGHT: Copyright C 2015 Accelerated Designs. All rights reserved; DATAINTERFACE: I²C Serial; DATASHEET: httpdatasheets.maximic.comendsMAX11606MAX11611.pdf; DESCRIPTION: IC ADC SERIAL 10BIT 8CH 16QSOP; DIGIKEYPARTNUMBER: MAX11608EEE+ND; MANUFACTURER_PART_NUMBER: MAX11608EEE+; MOUNTINGTYPE: Surface Mount; NUMBEROFBITS: 10; NUMBEROFCONVERTERS: 1; NUMBEROFINPUTSANDTYPE: 8 SingleEnded Unipolar 8 SingleEnded Bipolar 4 Differential Unipolar 4 Differential Bipolar; OPERATINGTEMPERATURE: 40°C ~ 85°C; PACKAGECASE: 16SSOP 0.154" 3.90mm Width; PACKAGING: Tube; POWERDISSIPATIONMAX: 666.7mW; QUANTITY_AVAILABLE: 814; SAMPLINGRATEPERSECOND: 94.4k; SUPPLIERDEVICEPACKAGE: 16QSOP; VENDOR: Maxim Integrated Products; VOLTAGESUPPLYSOURCE: Single Supply
U3 = Controller Board:TPS61256YFFR; MANUFACTURER_PART_NUMBER: TPS61256YFFR; VENDOR: Texas Instruments
U5 = lan9512:LAN9512-JZX; MANUFACTURER_PART_NUMBER: LAN9512JZX; VENDOR: MICROCHIP
U6 = Controller Board:COMPUTE_MODULE: Raspberry Pi Compute Module www.hasseb.fi
U7 = Controller Board:ESD5384
U8 U9 = Controller Board:PEC12R
U10 = Controller Board:TPS6209
U11 = Controller Board:LM3880MF-1AA/NOPB; MANUFACTURER_PART_NUMBER: lm3880mf1aaNOPB; VENDOR: National Semiconductor
U12 = Controller Board:APPLE_2.0C_COPROCESSOR
U16 = Controller Board:MIC23050
U17 = Controller Board:ATTINY10-TSHR; MANUFACTURER_PART_NUMBER: ATTINY10TSHR; VENDOR: Atmel
U18 = Controller Board:ESP12E: ESP12E Module
U19 = thanics_robotics:WM8960
U$2 = Controller Board:MICROSD
Y1 = thanics_robotics:DSC6001